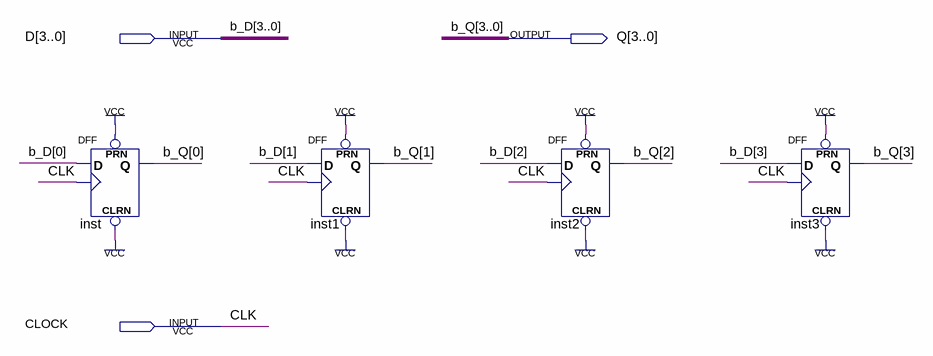
[diagram p0: schematic sheet]
// Quartus schematic Reg4Bits.bdf as structural Verilog: 4 symbols, 3 pins
module Reg4Bits (
  input  [3:0] D,
  input  CLOCK,
  output [3:0] Q
);

  DFF inst (.CLRN(1'b1), .CLK(CLOCK), .D(D[0]), .PRN(1'b1), .Q(Q[0]));
  DFF inst1 (.CLRN(1'b1), .CLK(CLOCK), .D(D[1]), .PRN(1'b1), .Q(Q[1]));
  DFF inst2 (.CLRN(1'b1), .CLK(CLOCK), .D(D[2]), .PRN(1'b1), .Q(Q[2]));
  DFF inst3 (.CLRN(1'b1), .CLK(CLOCK), .D(D[3]), .PRN(1'b1), .Q(Q[3]));

  // Other names for the same wires on the sheet: b_D[3:0] = D; b_Q[3:0] = Q; CLK = CLOCK
endmodule
